# EasyEDA Pro project pcb设计（在嘉立创eda打开）.epro

# Schematic Schematic1
Board Name: Board1; Create Date: 2025-09-08; Page Name: P1; Project Name: New Project_2025-09-08_15-11-54; Schematic Name: Schematic1; Update Date: 2025-09-10; Company: 嘉立创EDA; Page Size: A4; Version: V1.0
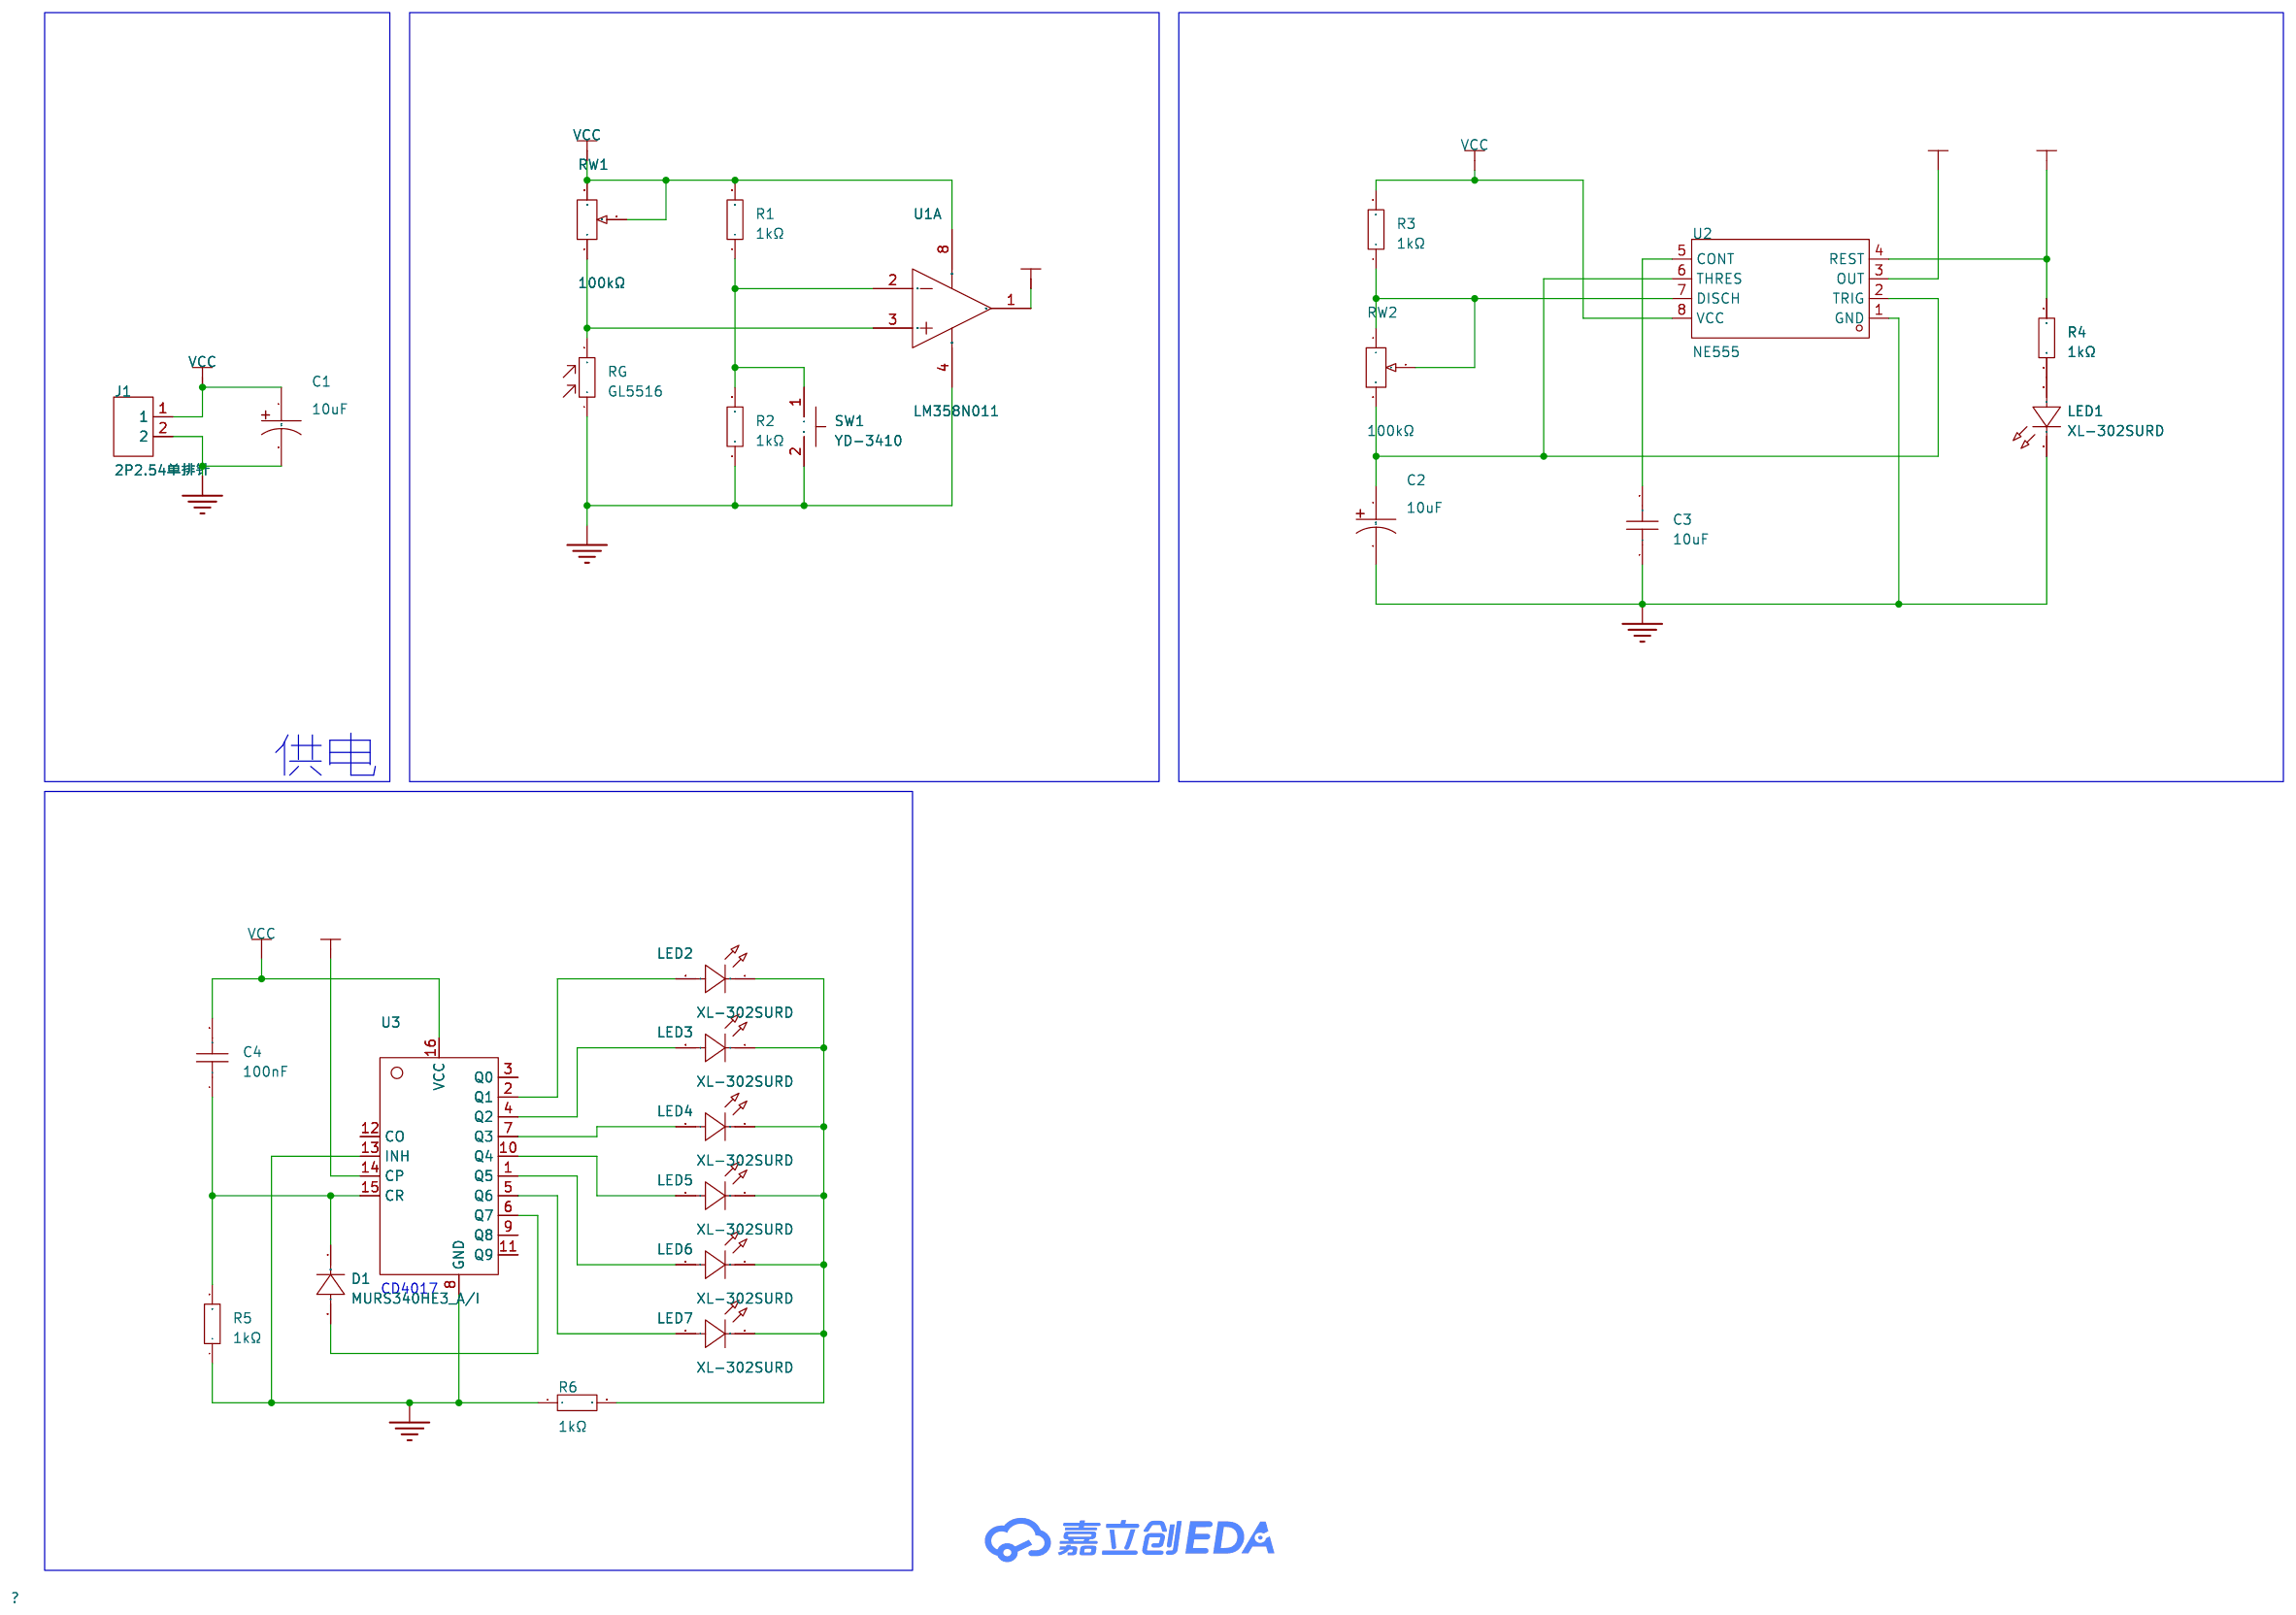
[diagram p0: schematic sheet]

## Parts
C1  10uF  [CAP-TH_BD8.0-P5.00-D1.0-FD]
C2  10uF  [CAP-TH_BD8.0-P5.00-D1.0-FD]
C3  10uF  [C0603]
C4  100nF  [C0603]
D1  MURS340HE3_A/I  [SMC_L6.9-W5.9-LS7.9-RD]
J1  2P2.54单排针  [HDR-TH_2P-P2.54-V-M]
LED1  XL-302SURD  [LED-TH_BD3.8-P2.54-RD]
LED2  XL-302SURD  [LED-TH_BD3.8-P2.54-RD]
LED3  XL-302SURD  [LED-TH_BD3.8-P2.54-RD]
LED4  XL-302SURD  [LED-TH_BD3.8-P2.54-RD]
LED5  XL-302SURD  [LED-TH_BD3.8-P2.54-RD]
LED6  XL-302SURD  [LED-TH_BD3.8-P2.54-RD]
LED7  XL-302SURD  [LED-TH_BD3.8-P2.54-RD]
R1  1kΩ  [RES-TH_BD2.5-L6.5-P10.50-D0.6]
R2  1kΩ  [RES-TH_BD2.5-L6.5-P10.50-D0.6]
R3  1kΩ  [RES-TH_BD2.5-L6.5-P10.50-D0.6]
R4  1kΩ  [RES-TH_BD2.5-L6.5-P10.50-D0.6]
R5  1kΩ  [RES-TH_BD2.5-L6.5-P10.50-D0.6]
R6  1kΩ  [RES-TH_BD2.5-L6.5-P10.50-D0.6]
RG  GL5516  [RES-TH_L5.1-W4.3-P3.40-D0.5]
RW1  100kΩ  [RES-ADJ-TH_3296W-1-203]
RW2  100kΩ  [RES-ADJ-TH_3296W-1-203]
SW1  YD-3410  [SW-SMD_L3.9-W2.9-LS4.8-EH-A]
U1  LM358N011  [PDIP-8_L9.6-W6.4-P2.54-LS7.6-BL]  (section 1)
U2  NE555  [DIP-8_L9.7-W6.4-P2.54-LS7.6-BL]
U3  -  [DIP-16]

## Library data of the parts
C1 C2 = MHA160V10M8*11.5 5.0TP: 容值:10uF;精度:±20%;额定电压:160V;纹波电流:82mA@120Hz;; LCSC Part Name: 10uF ±20% 160V; Supplier Part: C346989; Manufacturer: SAMYOUNG(韩国三莹); Supplier Footprint: 插件,D8xL11.5mm; JLCPCB Part Class: 扩展库; Datasheet: https://atta.szlcsc.com/upload/public/pdf/source/20190227/C371262_6482729EB227E13C9545E2EC5F97CBDC.pdf; Supplier: LCSC; Tolerance: ±20%; Rated Voltage: 160V; Ripple Current: 82mA@120Hz; Lead Spacing: 3.5mm; φD: 8mm; L: 11.5mm; Lifetime @ Temp: 2000hrs@85℃; Operating Temperature: -25℃~+85℃
C3 = CGA0603X5R106K100JT: 容值:10uF;精度:±10%;额定电压:10V;温度系数:X5R;; LCSC Part Name: 10uF ±10% 10V; Supplier Part: C6119842; Manufacturer: HRE(芯声); Supplier Footprint: 0603; JLCPCB Part Class: Extended Part; Supplier: LCSC; Tolerance: ±10%; Voltage Rating: 10V; Temperature Coefficient: X5R
C4 = CGA0603X7R104K500JT: 容值:100nF;精度:±10%;额定电压:50V;温度系数:X7R;; LCSC Part Name: 100nF ±10% 50V; Supplier Part: C6119867; Manufacturer: HRE(芯声); Supplier Footprint: 0603; JLCPCB Part Class: Extended Part; Datasheet: https://atta.szlcsc.com/upload/public/pdf/source/20250103/C44077DA9E7B3EFAE02F22B6D3D1CBC9.pdf; Supplier: LCSC; Tolerance: ±10%; Voltage Rating: 50V; Temperature Coefficient: X7R
D1 = MURS340HE3_A/I: 二极管配置:1个独立式;正向压降(Vf):1.25V;直流反向耐压(Vr):400V;整流电流:3A;反向恢复时间(Trr):50ns;; Supplier Part: C17326196; Manufacturer: VISHAY(威世); Supplier Footprint: DO-214AB(SMC); JLCPCB Part Class: 扩展库; Datasheet: https://item.szlcsc.com/datasheet/MURS340HE3_A%252FI/18455354.html; Supplier: LCSC; Diode Configuration: 1个独立式; Voltage - Forward(Vf@If): 1.25V; Voltage - DC Reverse(Vr): 400V; Current - Rectified: 3A; Reverse Leakage Current (Ir): 10uA@400V; Reverse Recovery Time (trr): 50ns; Operating Junction Temperature Range: -65℃~+175℃; Non-Repetitive Peak Forward Surge Current: 125A
J1 = 2P2.54单排针: Supplier Part: C9900015265; Supplier Footprint: HDR1X2; JLCPCB Part Class: 扩展库; Supplier: LCSC
LED1-LED7 = XL-302SURD: 灯头类型:3mm圆形灯头;发光颜色:红色;正向压降(Vf):2.2V;功率:50mW;正向电流:20mA;波长:620nm~630nm;二极管配置:-;透镜颜色:红色透镜;色温:-;发光强度:1000mcd;发光角度:35°;载带方式:-;工作温度:-20℃~+85℃;; Supplier Part: C2895470; Manufacturer: XINGLIGHT(成兴光); Supplier Footprint: 插件,D=3mm; JLCPCB Part Class: 扩展库; Datasheet: https://item.szlcsc.com/datasheet/XL-302SURD/3136185.html; Supplier: LCSC; Lamp Holder Type: 3mm圆形灯头; Illumination Color: 红色; Voltage - Forward(Vf): 2.2V; Power(Watts): 50mW; Forward Current: 20mA; Wavelength - Dominant: 620nm~630nm; Peak Wavelength: 625nm; Lens Color: 红色透镜; Luminous Intensity: 1000mcd; Viewing Angle: 35°; Operating Temperature: -20℃~+85℃
R1-R6 = MFR0W4F1001A50: 电阻类型:金属膜电阻;阻值:1kΩ;精度:±1%;功率:250mW;温度系数:±50ppm/℃;; LCSC Part Name: 1kΩ ±1% 250mW 金属膜电阻 铜脚，圆柱状直插; Supplier Part: C57435; Manufacturer: UNI-ROYAL(厚声); Supplier Footprint: 插件,D2.2xL6.5mm; JLCPCB Part Class: Extended Part; Datasheet: https://atta.szlcsc.com/upload/public/pdf/source/20191012/C436293_8820AA14BC71FA35E551C06C441482A0.pdf; Supplier: LCSC; Type: 金属膜电阻; Tolerance: ±1%; Voltage-Supply(Max): 250V; Power(Watts): 250mW; Temperature Coefficient: ±50ppm/℃
RG = GL5516: 暗电阻:500kΩ;亮电阻 @ 10Lux:5kΩ~10kΩ;光谱峰值(波长):540nm;; LCSC Part Name: 亮电阻:5kΩ~10kΩ 暗电阻:500kΩ; Supplier Part: C125626; Manufacturer: 森霸; Supplier Footprint: 插件,P=3mm; JLCPCB Part Class: 扩展库; Datasheet: https://atta.szlcsc.com/upload/public/pdf/source/20170810/C125631_1502335367544879947.pdf; Supplier: LCSC; Dark Resistance: 500kΩ; Illuminated Resistance @ 10Lux: 5kΩ~10kΩ; Applied Voltage: 150V; Spectral Peak: 540nm
RW1 RW2 = 3296W-1-104_C48997936: 阻值:100kΩ;精度:±10%;功率:500mW;温度系数:±250ppm/℃;; LCSC Part Name: 3296W-1-104; Supplier Part: C48997936; Manufacturer: JIERR(捷而瑞); Manufacturer Part: 3296W-1-104; Supplier Footprint: 插件-3P,9.5x4.9mm; JLCPCB Part Class: 扩展库; Datasheet: https://item.szlcsc.com/datasheet/3296W-1-104/51342072.html; Supplier: LCSC; Tolerance: ±10%; Power(Watts): 500mW; Temperature Coefficient: ±250ppm/℃; Number of Turns: 28
SW1 = YD-3410: Supplier Part: C9900006416; Supplier Footprint: SW-PB; JLCPCB Part Class: 扩展库; Supplier: LCSC
U1 = LM358N011: Supplier Part: C51026329; Manufacturer: GMIC(绿微); Supplier Footprint: DIP-8; JLCPCB Part Class: 扩展库; Datasheet: https://item.szlcsc.com/datasheet/LM358N011/53673007.html; Supplier: LCSC
U2 = NE555_C504550: Supplier Part: C504550; Supplier Footprint: DIP-8; JLCPCB Part Class: 扩展库; Supplier: LCSC
U3 = CD4017_course

## Nets
GND: C1.2 C2.2 C3.1 J1.2 LED1.1(K) R2.1 R5.1 R6.1 RG.1 SW1.2 U1.4(GND) U2.1(GND) U3.8(GND) U3.13(INH)
VCC: C1.1 C4.2 J1.1 R1.2 R3.2 RW1.2 RW1.3 U1.8(VCC) U2.8(VCC) U3.16(VCC)
VAD: R4.1 U1.1(OUT A) U2.4(REST)
VOUT: U2.3(OUT) U3.14(CP)
$1N2743: R1.1 R2.2 SW1.1 U1.2(IN A-)
$1N2812: RG.2 RW1.1 U1.3(IN A+)
$1N3121: R3.1 RW2.1 RW2.2 U2.7(DISCH)
$1N3221: C3.2 U2.5(CONT)
$1N3431: LED1.2(A) R4.2
$1N3614: C2.1 RW2.3 U2.2(TRIG) U2.6(THRES)
$1N3881: LED2.1(K) LED3.1(K) LED4.1(K) LED5.1(K) LED6.1(K) LED7.1(K) R6.2
$1N4028: LED2.2(A) U3.2(Q1)
$1N4034: LED3.2(A) U3.4(Q2)
$1N4041: LED4.2(A) U3.7(Q3)
$1N4048: LED5.2(A) U3.10(Q4)
$1N4055: LED6.2(A) U3.1(Q5)
$1N4062: LED7.2(A) U3.5(Q6)
$1N4081: C4.1 D1.1(C) R5.2 U3.15(CR)
$1N4142: D1.2(A) U3.6(Q7)

Not connected (* = marked no-connect by the designer): U3 3(Q0) 9(Q8) 11(Q9) 12(CO)

## Notes on the sheet
- 供电

# Board PCB1
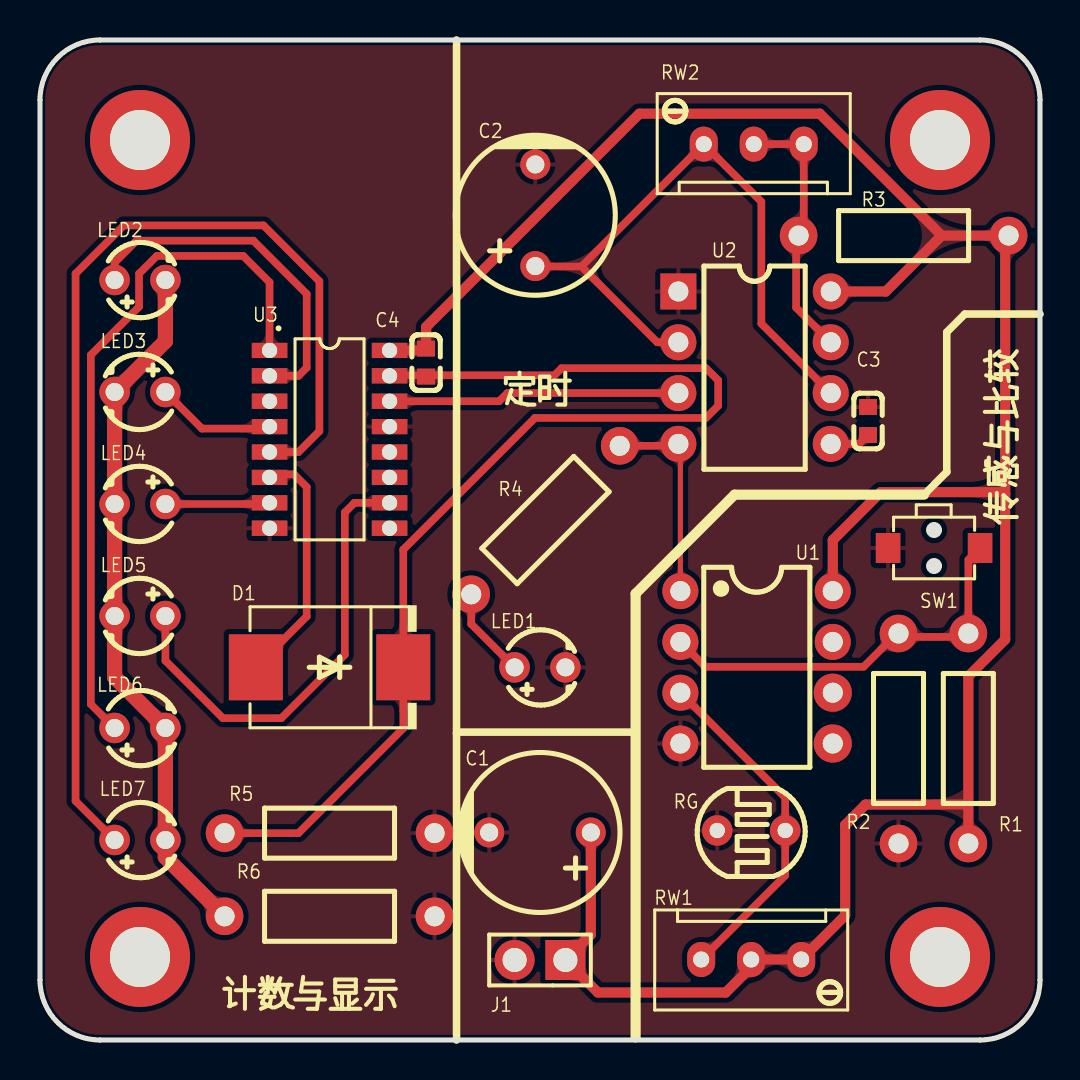
[diagram p1: board, top side]
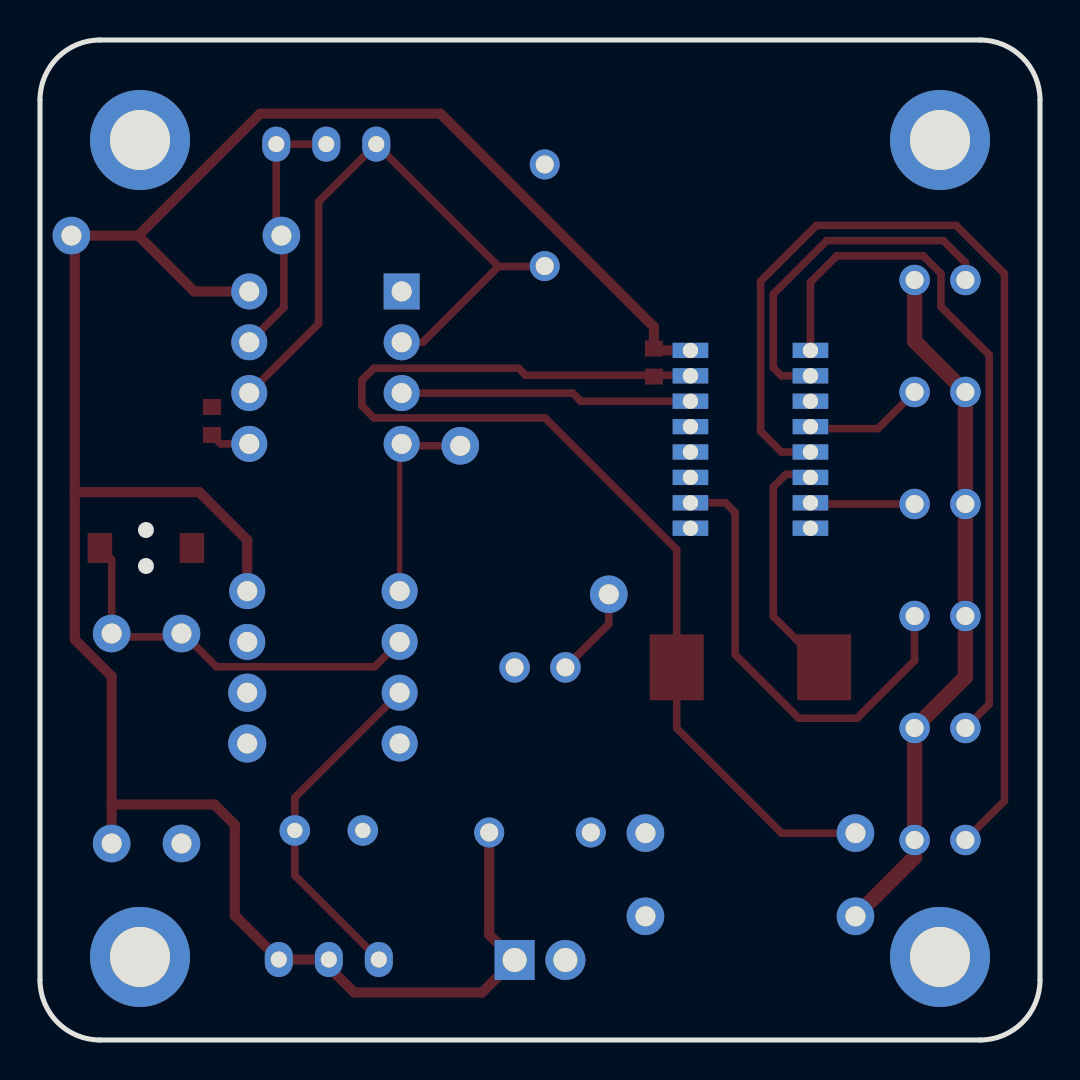
[diagram p2: board, bottom side, seen from below]

Outline 50 x 50 mm; copper layers: Top Layer, Bottom Layer. Coordinates in mm from the lower left corner of the outline.
Outline path: 0,47 0,3 arc(0.88,0.88) 3,0 47,0 arc(49.12,0.88) 50,3 50,47 arc(49.12,49.12) 47,50 3,50 arc(0.88,49.12) 0,47
Stack: Top Layer 0.035mm / Dielectric1 1.51mm FR4 er 4.5 / Bottom Layer 0.035mm

## Design rules (mm)
template: JLCPCB Capability(Two Layers Board)
spacing copperThickness1oz (default): track to track 0.102, other pairs 0.152 to 0.3
spacing copperThickness2oz: track to track 0.203, other pairs 0.152 to 0.3
track width copperThickness1oz (default): min 0.127, default 0.254, max 2.54
track width copperThickness2oz: min 0.203, default 0.254, max 2.54
differential pair differentialPair (default): width min 0.127, default 0.254, max 2.54; gap min 0.152, default 0.152
via viaSize (default): diameter min 0.5, default 0.61, max 10; hole min 0.3, default 0.305, max 6.3

## Placement (name value [footprint] x y rotation side)
C1  10uF  [CAP-TH_BD8.0-P5.00-D1.0-FD]  25 10.38 180 top
C2  10uF  [CAP-TH_BD8.0-P5.00-D1.0-FD]  24.76 41.24 90 top
C3  10uF  [C0603]  41.4 30.95 270 top
C4  100nF  [C0603]  19.3 33.87 90 top
D1  MURS340HE3_A/I  [SMC_L6.9-W5.9-LS7.9-RD]  14.48 18.64 180 top
J1  2P2.54单排针  [HDR-TH_2P-P2.54-V-M]  25 4 180 top
LED1  XL-302SURD  [LED-TH_BD3.8-P2.54-RD]  25 18.63 180 top
LED2  XL-302SURD  [LED-TH_BD3.8-P2.54-RD]  5 38 180 top
LED3  XL-302SURD  [LED-TH_BD3.8-P2.54-RD]  5 32.4 0 top
LED4  XL-302SURD  [LED-TH_BD3.8-P2.54-RD]  5 26.8 0 top
LED5  XL-302SURD  [LED-TH_BD3.8-P2.54-RD]  5 21.2 0 top
LED6  XL-302SURD  [LED-TH_BD3.8-P2.54-RD]  5 15.6 180 top
LED7  XL-302SURD  [LED-TH_BD3.8-P2.54-RD]  5 10 180 top
NOREF  -  [Pad_e40]  45 45 0 top
NOREF#2  -  [Pad_e42]  45 4.15 0 top
NOREF#3  -  [Pad_e38]  5 45 0 top
NOREF#4  -  [Pad_e41]  5 4.15 0 top
R1  1kΩ  [RES-TH_BD2.5-L6.5-P10.50-D0.6]  46.42 15.08 270 top
R2  1kΩ  [RES-TH_BD2.5-L6.5-P10.50-D0.6]  42.93 15.08 90 top
R3  1kΩ  [RES-TH_BD2.5-L6.5-P10.50-D0.6]  43.18 40.22 0 top
R4  1kΩ  [RES-TH_BD2.5-L6.5-P10.50-D0.6#2]  25.27 26 225 top
R5  1kΩ  [RES-TH_BD2.5-L6.5-P10.50-D0.6]  14.48 10.34 180 top
R6  1kΩ  [RES-TH_BD2.5-L6.5-P10.50-D0.6]  14.48 6.19 180 top
RG  GL5516  [RES-TH_L5.1-W4.3-P3.40-D0.5]  35.56 10.48 90 top
RW1  100kΩ  [RES-ADJ-TH_3296W-1-203]  35.56 4.03 0 top
RW2  100kΩ  [RES-ADJ-TH_3296W-1-203]  35.69 44.79 180 top
SW1  YD-3410  [SW-SMD_L3.9-W2.9-LS4.8-EH-A]  44.7 24.6 180 top
U1  LM358N011  [PDIP-8_L9.6-W6.4-P2.54-LS7.6-BL]  35.83 18.63 270 top
U2  NE555  [DIP-8_L9.7-W6.4-P2.54-LS7.6-BL]  35.73 33.62 270 top
U3  -  [DIP-16]  14.48 30.03 0 top

## Footprints (pads in the part's own frame, mm; a bottom-side part is the same pattern mirrored in y, then rotated)
C0603
  rect 0.8x0.9 smd: 1(-0.7,0) 2(0.7,0)
CAP-TH_BD8.0-P5.00-D1.0-FD
  round 1.5 hole 0.9: 1(-2.54,0) 2(2.54,0)
DIP-8_L9.7-W6.4-P2.54-LS7.6-BL
  rect 1.8x1.8 hole 1: 1(-3.81,-3.81)
  round 1.8 hole 1: 2(-1.27,-3.81) 3(1.27,-3.81) 4(3.81,-3.81) 5(3.81,3.81) 6(1.27,3.81) 7(-1.27,3.81) 8(-3.81,3.81)
DIP-16
  rect 1.775x0.762 hole 0.762: 1(-3,4.445) 2(-3,3.175) 3(-3,1.905) 4(-3,0.635) 5(-3,-0.635) 6(-3,-1.905) 7(-3,-3.175) 8(-3,-4.445) 9(3,-4.445) 10(3,-3.175) 11(3,-1.905) 12(3,-0.635) 13(3,0.635) 14(3,1.905) 15(3,3.175) 16(3,4.445)
HDR-TH_2P-P2.54-V-M
  rect 2x2 hole 1.2: 1(-1.27,0)
  round 2 hole 1.2: 2(1.27,0)
LED-TH_BD3.8-P2.54-RD
  round 1.524 hole 0.9: 1(-1.27,0) 2(1.27,0)
Pad_e38
  round 5 hole 3: 1(0,0)
Pad_e40
  round 5 hole 3: 1(0,0)
Pad_e41
  round 5 hole 3: 1(0,0)
Pad_e42
  round 5 hole 3: 1(0,0)
PDIP-8_L9.6-W6.4-P2.54-LS7.6-BL
  round 1.8 hole 1: 1(-3.81,-3.81) 2(-1.27,-3.81) 3(1.27,-3.81) 4(3.81,-3.81) 7(-1.27,3.81) 8(-3.81,3.81)
  round 1.905 hole 1: 5(3.81,3.81) 6(1.27,3.81)
RES-ADJ-TH_3296W-1-203
  oval 1.4x1.75 hole 0.8: 1(-2.5,0) 2(0,0) 3(2.5,0)
RES-TH_BD2.5-L6.5-P10.50-D0.6
  round 1.879 hole 1: 1(-5.25,0) 2(5.25,0)
RES-TH_BD2.5-L6.5-P10.50-D0.6#2
  round 1.879 hole 1: 1(-5.25,0) 2(5.25,0)
RES-TH_L5.1-W4.3-P3.40-D0.5
  round 1.524 hole 0.762: 1(0,1.7) 2(0,-1.7)
SMC_L6.9-W5.9-LS7.9-RD
  rect 2.7x3.3 smd: 1(-3.687,0) 2(3.687,0)
SW-SMD_L3.9-W2.9-LS4.8-EH-A
  rect 1.23x1.5 smd: 1(-2.3,0) 2(2.3,0)

## Nets
As in the schematic.

Pads without a net: NOREF 1; NOREF#2 1; NOREF#3 1; NOREF#4 1; U1 5 6 7; U3 3 9 11 12

## Routing (per net, layer and track width the routed paths; a pad name or vN(x,y) marks a point on that pad's centre or on a via; arc(x,y) is an arc through that point)
VCC: length 123.3
  Top Layer w0.508: 46.42,11.77 46.42,18.19 48.26,20.03 48.26,27.31 ; 46.42,11.77 41.28,11.77 40.26,10.76 40.26,6.22 RW1.3 RW1.2 35.56,3.64 34.29,2.38 27.9,2.38 J1.1 27.54,5.27 C1.1 ; 46.42,11.77 46.42,9.97 ; 48.26,27.31 48.18,27.39 42.04,27.39 39.64,25 U1.8 ; 48.26,27.31 48.26,40.22 45.09,40.22 ; U2.8 42.29,37.43 45.09,40.22 ; 45.09,40.22 38.99,46.32 29.97,46.32 19.3,35.65 19.3,34.48 U3.16
VAD: length 10.4
  Top Layer w0.254: U2.4 32.02,29.71 U1.1
  Top Layer w0.381: R4.1 31.82,29.71 U2.4
VOUT: length 14.6
  Top Layer w0.381: U2.3 23.37,32.35 22.96,31.94 U3.14
$1N2743: length 20.2
  Top Layer w0.381: U1.2 33.26,18.66 41.18,18.66 42.67,20.16 46.42,20.16 46.42,24.01 SW1.1
$1N2812: length 17.3
  Top Layer w0.381: U1.3 37.26,12.12 RG.2 37.26,8.22 RW1.1
$1N3121: length 13.3
  Top Layer w0.381: RW2.2 RW2.1 38.19,40.31 37.81,39.93 37.81,36.62 U2.7
$1N3221: length 2
  Top Layer w0.381: C3.2 40.96,29.81 U2.5
$1N3431: length 4.6
  Top Layer w0.381: LED1.2 21.56,20.8 R4.2
$1N3614: length 32.3
  Top Layer w0.381: U2.6 36.07,35.82 36.07,41.91 RW2.3 27.07,38.68 ; 27.07,38.68 25.23,38.68 25,38.44 ; 27.07,38.68 30.86,34.89 U2.2
$1N3881: length 35.1
  Top Layer w0.762: R6.2 6.27,9.14 LED7.1 LED6.1 3.73,18.14 LED5.1 LED4.1 LED3.1 6.27,34.94 LED2.1
$1N4028: length 17.7
  Top Layer w0.381: LED2.2 3.73,38.87 4.83,39.97 10.67,39.97 13.34,37.3 13.34,33.62 12.93,33.21 U3.2
$1N4034: length 6
  Top Layer w0.381: LED3.2 8.1,30.57 11.38,30.57 U3.4
$1N4041: length 5.2
  Top Layer w0.381: LED4.2 11.42,26.8 U3.7
$1N4048: length 23.3
  Top Layer w0.381: U3.10 15.72,26.86 15.24,26.38 15.24,19.27 12.06,16.09 9.14,16.09 6.27,18.97 LED5.2
$1N4055: length 35.1
  Top Layer w0.381: U3.1 11.48,37.89 10.16,39.2 5.84,39.2 4.95,38.32 4.95,36.67 2.54,34.25 2.54,16.79 LED6.2
$1N4062: length 53.9
  Top Layer w0.381: LED7.2 1.78,11.95 1.78,38.32 4.19,40.73 11.18,40.73 13.97,37.94 13.97,30.44 12.93,29.4 U3.5
$1N4081: length 56.7
  Top Layer w0.381: U3.15 17.51,33.24 25.72,33.24 26.08,33.59 33.3,33.59 33.91,32.98 33.91,31.71 33.3,31.1 24.75,31.1 18.16,24.52 D1.1 18.16,15.59 12.92,10.34 9.4,10.34
$1N4142: length 12.3
  Top Layer w0.381: D1.2 13.34,21.18 13.34,27.65 12.7,28.28 11.63,28.28 U3.6

## Copper pours and planes (outline as drawn; the poured copper is in the pictures)
GND on Top Layer: -2.67,51.91 54.23,51.91 54.23,-2.07 -2.67,-2.07

Small or netless copper shapes (teardrops, artwork), in the pictures only: 82 on Top Layer

## Text on the board
Top Silkscreen Layer: 传感与比较 | 计数与显示 | 定时
